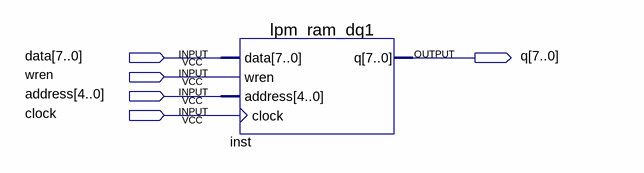
[diagram p0: schematic sheet]
// Quartus schematic cchq32.bdf as structural Verilog: 1 symbols, 5 pins
module cchq32 (
  input  [7:0] data,
  input  wren,
  input  [4:0] address,
  input  clock,
  output [7:0] q
);

  lpm_ram_dq1 inst (.data(data), .wren(wren), .address(address), .clock(clock), .q(q));
endmodule
